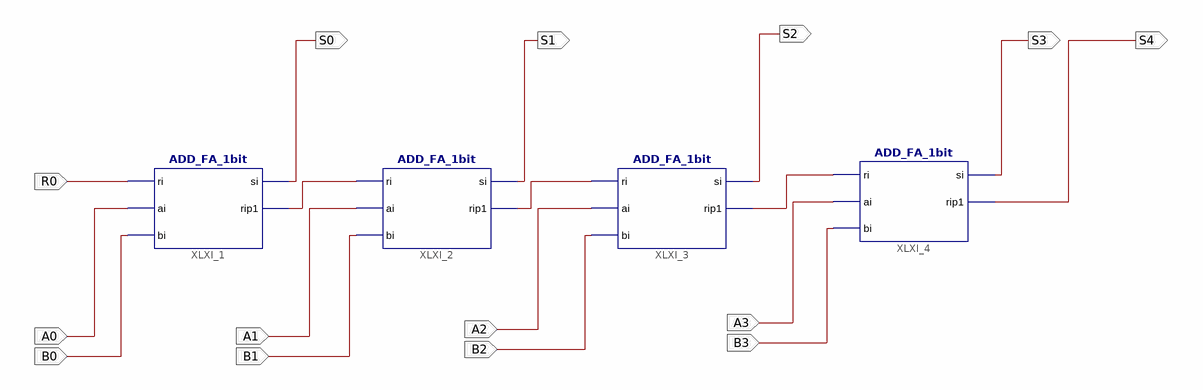
[diagram p0: schematic sheet 1]
// Xilinx ISE schematic ADD_FA_4bits.sch (artix7) as structural Verilog: 4 symbols, 14 ports
module ADD_FA_4bits (
  input  B0,
  input  B1,
  input  B2,
  input  A3,
  input  B3,
  input  A0,
  input  A1,
  input  A2,
  input  R0,
  output S0,
  output S1,
  output S3,
  output S2,
  output S4
);

  wire XLXN_38, XLXN_39, XLXN_40;

  ADD_FA_1bit XLXI_1 (.ri(R0), .ai(A0), .bi(B0), .si(S0), .rip1(XLXN_38));
  ADD_FA_1bit XLXI_2 (.ri(XLXN_38), .ai(A1), .bi(B1), .si(S1), .rip1(XLXN_39));
  ADD_FA_1bit XLXI_3 (.ri(XLXN_39), .ai(A2), .bi(B2), .si(S2), .rip1(XLXN_40));
  ADD_FA_1bit XLXI_4 (.ri(XLXN_40), .ai(A3), .bi(B3), .si(S3), .rip1(S4));
endmodule
